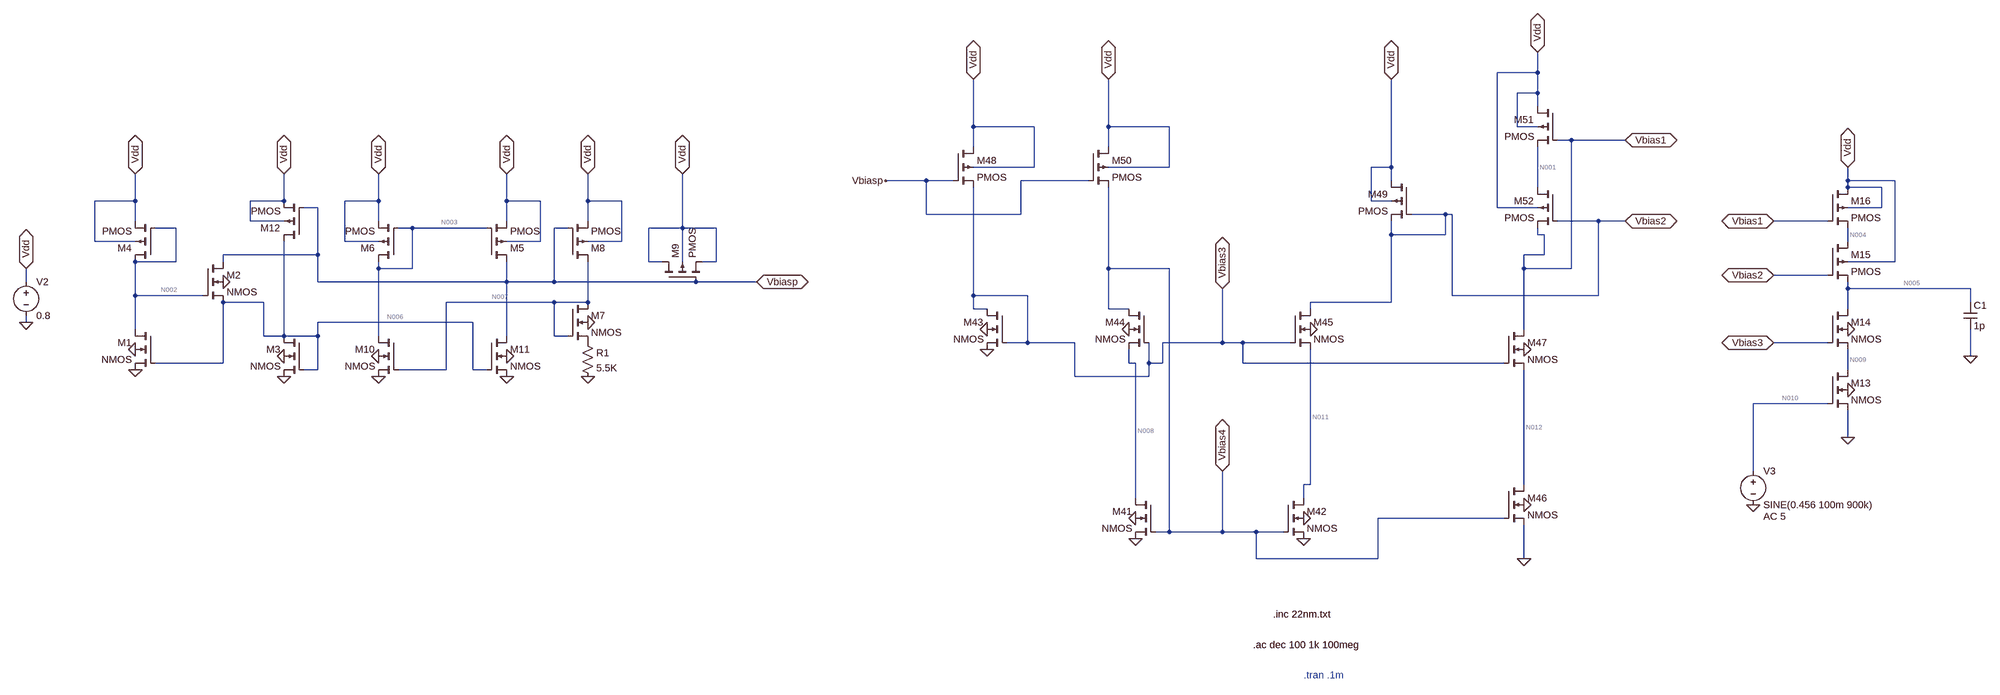
[diagram p0: schematic Schematic_22n.asc]
Schematic_22n.asc, the LTspice schematic file:
Version 4
SHEET 1 5816 3252
WIRE 3472 -384 3472 -432
WIRE 3472 -384 3376 -384
WIRE 3472 -336 3472 -384
WIRE 3472 -336 3424 -336
WIRE 3472 -304 3472 -336
WIRE 2064 -256 2064 -368
WIRE 2208 -256 2064 -256
WIRE 2384 -256 2384 -368
WIRE 2528 -256 2384 -256
WIRE 3424 -256 3424 -336
WIRE 3472 -256 3424 -256
WIRE 3552 -224 3520 -224
WIRE 3680 -224 3552 -224
WIRE 2064 -208 2064 -256
WIRE 2384 -208 2384 -256
WIRE 2208 -160 2208 -256
WIRE 2208 -160 2064 -160
WIRE 2528 -160 2528 -256
WIRE 2528 -160 2384 -160
WIRE 3104 -160 3104 -368
WIRE 3104 -160 3056 -160
WIRE 1952 -128 1856 -128
WIRE 2016 -128 1952 -128
WIRE 2336 -128 2176 -128
WIRE 3104 -128 3104 -160
WIRE 4832 -128 4832 -160
WIRE 4944 -128 4832 -128
WIRE 3472 -112 3472 -208
WIRE 4832 -112 4832 -128
WIRE 4912 -112 4832 -112
WIRE 0 -80 0 -144
WIRE 0 -80 -96 -80
WIRE 352 -80 352 -144
WIRE 352 -80 272 -80
WIRE 576 -80 576 -144
WIRE 576 -80 496 -80
WIRE 880 -80 880 -144
WIRE 960 -80 880 -80
WIRE 1072 -80 1072 -144
WIRE 1152 -80 1072 -80
WIRE 3056 -80 3056 -160
WIRE 3104 -80 3056 -80
WIRE 432 -64 400 -64
WIRE 3376 -64 3376 -384
WIRE 3472 -64 3376 -64
WIRE 4912 -64 4912 -112
WIRE 4912 -64 4832 -64
WIRE 1952 -48 1952 -128
WIRE 2176 -48 2176 -128
WIRE 2176 -48 1952 -48
WIRE 3232 -48 3152 -48
WIRE 3248 -48 3232 -48
WIRE 0 -32 0 -80
WIRE 272 -32 272 -80
WIRE 352 -32 272 -32
WIRE 576 -32 576 -80
WIRE 880 -32 880 -80
WIRE 1072 -32 1072 -80
WIRE 3616 -32 3520 -32
WIRE 3680 -32 3616 -32
WIRE 4784 -32 4656 -32
WIRE 96 -16 48 -16
WIRE 656 -16 624 -16
WIRE 832 -16 656 -16
WIRE 1024 -16 992 -16
WIRE 1296 -16 1296 -144
WIRE 1296 -16 1216 -16
WIRE 1376 -16 1296 -16
WIRE 3104 0 3104 -32
WIRE 3232 0 3232 -48
WIRE 3232 0 3104 0
WIRE 3472 0 3472 -16
WIRE 3488 0 3472 0
WIRE -96 16 -96 -80
WIRE 0 16 -96 16
WIRE 496 16 496 -80
WIRE 576 16 496 16
WIRE 960 16 960 -80
WIRE 960 16 880 16
WIRE 1152 16 1152 -80
WIRE 1152 16 1072 16
WIRE 4832 16 4832 -16
WIRE 432 48 432 -64
WIRE 432 48 208 48
WIRE 3488 48 3488 0
WIRE 3488 48 3440 48
WIRE 0 64 0 48
WIRE 96 64 96 -16
WIRE 96 64 0 64
WIRE 208 64 208 48
WIRE 1216 64 1216 -16
WIRE 1248 64 1216 64
WIRE 1296 64 1296 -16
WIRE 1376 64 1376 -16
WIRE 1376 64 1344 64
WIRE 4944 64 4944 -128
WIRE 4944 64 4832 64
WIRE 576 80 576 64
WIRE 656 80 656 -16
WIRE 656 80 576 80
WIRE 2384 80 2384 -112
WIRE 2528 80 2384 80
WIRE 3440 80 3440 48
WIRE 3552 80 3552 -224
WIRE 3552 80 3440 80
WIRE 4784 96 4656 96
WIRE -432 112 -432 80
WIRE 432 112 432 48
WIRE 880 112 880 64
WIRE 880 112 432 112
WIRE 992 112 992 -16
WIRE 992 112 880 112
WIRE 1328 112 992 112
WIRE 1472 112 1328 112
WIRE 4832 128 4832 112
WIRE 5136 128 4832 128
WIRE 0 144 0 64
WIRE 160 144 0 144
WIRE 2064 144 2064 -112
WIRE 2192 144 2064 144
WIRE 3248 144 3248 -48
WIRE 3616 144 3616 -32
WIRE 3616 144 3248 144
WIRE 304 160 208 160
WIRE 992 160 736 160
WIRE 1072 160 1072 64
WIRE 1072 160 992 160
WIRE 3104 160 3104 0
WIRE 3104 160 2912 160
WIRE 5136 160 5136 128
WIRE 2064 176 2064 144
WIRE 2096 176 2064 176
WIRE 2384 176 2384 80
WIRE 2432 176 2384 176
WIRE 2912 176 2912 160
WIRE 4832 176 4832 128
WIRE -432 208 -432 192
WIRE 800 208 432 208
WIRE 0 224 0 144
WIRE 3440 224 3440 80
WIRE 304 240 304 160
WIRE 352 240 352 16
WIRE 352 240 304 240
WIRE 432 240 432 208
WIRE 432 240 352 240
WIRE 576 240 576 80
WIRE 880 240 880 112
WIRE 992 240 992 160
WIRE 1024 240 992 240
WIRE 352 256 352 240
WIRE 2192 256 2192 144
WIRE 2192 256 2144 256
WIRE 2304 256 2192 256
WIRE 2704 256 2704 128
WIRE 2704 256 2512 256
WIRE 2752 256 2704 256
WIRE 2864 256 2752 256
WIRE 4784 256 4656 256
WIRE 5136 288 5136 224
WIRE 208 304 208 160
WIRE 208 304 48 304
WIRE 2432 304 2432 272
WIRE 2448 304 2432 304
WIRE 2480 304 2480 256
WIRE 2512 304 2512 256
WIRE 2512 304 2480 304
WIRE 2752 304 2752 256
WIRE 3392 304 2752 304
WIRE 432 320 432 240
WIRE 432 320 400 320
WIRE 736 320 736 160
WIRE 736 320 624 320
WIRE 800 320 800 208
WIRE 832 320 800 320
WIRE 4832 320 4832 272
WIRE 2304 336 2304 256
WIRE 2480 336 2480 304
WIRE 2480 336 2304 336
WIRE 4784 400 4608 400
WIRE 4832 480 4832 416
WIRE 4608 560 4608 400
WIRE 2912 592 2912 272
WIRE 2912 592 2896 592
WIRE 3440 592 3440 320
WIRE 2448 624 2448 304
WIRE 2896 624 2896 592
WIRE 3392 672 3072 672
WIRE 2528 704 2528 80
WIRE 2528 704 2496 704
WIRE 2704 704 2704 560
WIRE 2704 704 2528 704
WIRE 2784 704 2704 704
WIRE 2848 704 2784 704
WIRE 2784 768 2784 704
WIRE 3072 768 3072 672
WIRE 3072 768 2784 768
WIRE 3440 768 3440 688
FLAG 0 320 0
FLAG 352 336 0
FLAG 576 336 0
FLAG 880 336 0
FLAG 1072 336 0
FLAG 1072 208 0
FLAG 0 272 0
FLAG 352 288 0
FLAG 576 288 0
FLAG 880 288 0
FLAG -432 208 0
FLAG -432 80 Vdd
IOPIN -432 80 BiDir
FLAG 576 -144 Vdd
IOPIN 576 -144 BiDir
FLAG 352 -144 Vdd
IOPIN 352 -144 BiDir
FLAG 0 -144 Vdd
IOPIN 0 -144 BiDir
FLAG 880 -144 Vdd
IOPIN 880 -144 BiDir
FLAG 1072 -144 Vdd
IOPIN 1072 -144 BiDir
FLAG 1296 -144 Vdd
IOPIN 1296 -144 BiDir
FLAG 4656 96 Vbias2
IOPIN 4656 96 BiDir
FLAG 208 112 0
FLAG 1472 112 Vbiasp
IOPIN 1472 112 BiDir
FLAG 2448 720 0
FLAG 2896 720 0
FLAG 2448 672 0
FLAG 2896 672 0
FLAG 2096 272 0
FLAG 2096 224 0
FLAG 2432 224 0
FLAG 2912 224 0
FLAG 3440 768 0
FLAG 3440 640 0
FLAG 3440 272 0
FLAG 1856 -128 Vbiasp
FLAG 2064 -368 Vdd
IOPIN 2064 -368 BiDir
FLAG 2384 -368 Vdd
IOPIN 2384 -368 BiDir
FLAG 3104 -368 Vdd
IOPIN 3104 -368 BiDir
FLAG 3472 -432 Vdd
IOPIN 3472 -432 BiDir
FLAG 3680 -224 Vbias1
IOPIN 3680 -224 BiDir
FLAG 3680 -32 Vbias2
IOPIN 3680 -32 BiDir
FLAG 2704 128 Vbias3
IOPIN 2704 128 BiDir
FLAG 2704 560 Vbias4
IOPIN 2704 560 BiDir
FLAG 5136 288 0
FLAG 4608 640 0
FLAG 4832 480 0
FLAG 4832 368 0
FLAG 4832 224 0
FLAG 4656 256 Vbias3
IOPIN 4656 256 BiDir
FLAG 4656 -32 Vbias1
IOPIN 4656 -32 BiDir
FLAG 4832 -160 Vdd
IOPIN 4832 -160 BiDir
SYMBOL nmos4 48 224 M0
SYMATTR InstName M1
SYMATTR Value2 l=44n w=220n
SYMBOL nmos4 160 64 R0
SYMATTR InstName M2
SYMATTR Value2 l=44n w=88n
SYMBOL nmos4 400 240 M0
SYMATTR InstName M3
SYMATTR Value2 l=44n w=220n
SYMBOL pmos4 48 64 R180
SYMATTR InstName M4
SYMATTR Value2 l=440n w=220n
SYMBOL pmos4 832 64 M180
SYMATTR InstName M5
SYMATTR Value2 l=44n w=528n
SYMBOL pmos4 624 64 R180
SYMATTR InstName M6
SYMATTR Value2 l=44n w=528n
SYMBOL nmos4 1024 160 R0
SYMATTR InstName M7
SYMATTR Value2 l=44n w=660n
SYMBOL res 1056 240 R0
SYMATTR InstName R1
SYMATTR Value 5.5K
SYMBOL pmos4 1024 64 M180
SYMATTR InstName M8
SYMATTR Value2 l=44n w=528n
SYMBOL pmos4 1248 112 R270
SYMATTR InstName M9
SYMATTR Value2 l=1100n w=1100n
SYMBOL nmos4 624 240 M0
SYMATTR InstName M10
SYMATTR Value2 l=44n w=220n
SYMBOL nmos4 832 240 R0
SYMATTR InstName M11
SYMATTR Value2 l=44n w=220n
SYMBOL pmos4 400 16 R180
SYMATTR InstName M12
SYMATTR Value2 l=44n w=528n
SYMBOL voltage -432 96 R0
WINDOW 123 0 0 Left 0
WINDOW 39 0 0 Left 0
SYMATTR InstName V2
SYMATTR Value 0.8
SYMBOL nmos4 2496 624 M0
SYMATTR InstName M41
SYMATTR Value2 l=22n w=110n
SYMBOL nmos4 2848 624 R0
SYMATTR InstName M42
SYMATTR Value2 l=22n w=110n
SYMBOL nmos4 2144 176 M0
SYMATTR InstName M43
SYMATTR Value2 l=22n w=55n
SYMBOL nmos4 2480 176 M0
SYMATTR InstName M44
SYMATTR Value2 l=22n w=110n
SYMBOL nmos4 2864 176 R0
SYMATTR InstName M45
SYMATTR Value2 l=22n w=110n
SYMBOL nmos4 3392 592 R0
SYMATTR InstName M46
SYMATTR Value2 l=22n w=110n
SYMBOL nmos4 3392 224 R0
SYMATTR InstName M47
SYMATTR Value2 l=22n w=110n
SYMBOL pmos4 2016 -208 R0
SYMATTR InstName M48
SYMATTR Value2 l=22n w=264n
SYMBOL pmos4 3152 -128 M0
SYMATTR InstName M49
SYMATTR Value2 l=22n w=88n
SYMBOL pmos4 2336 -208 R0
SYMATTR InstName M50
SYMATTR Value2 l=22n w=264n
SYMBOL pmos4 3520 -304 M0
SYMATTR InstName M51
SYMATTR Value2 l=22n w=264n
SYMBOL pmos4 3520 -112 M0
SYMATTR InstName M52
SYMATTR Value2 l=22n w=264n
SYMBOL voltage 4608 544 R0
WINDOW 123 24 124 Left 2
WINDOW 39 0 0 Left 0
SYMATTR Value2 AC 5
SYMATTR InstName V3
SYMATTR Value SINE(0.456 100m 900k)
SYMBOL cap 5120 160 R0
SYMATTR InstName C1
SYMATTR Value 1p
SYMBOL nmos4 4784 320 R0
SYMATTR InstName M13
SYMATTR Value2 l=22n w=374n
SYMBOL nmos4 4784 176 R0
SYMATTR InstName M14
SYMATTR Value2 l=22n w=330n
SYMBOL pmos4 4784 16 R0
SYMATTR InstName M15
SYMATTR Value2 l=22n w=500n
SYMBOL pmos4 4784 -112 R0
SYMATTR InstName M16
SYMATTR Value2 l=22n w=748n
TEXT 2824 928 Left 2 !.inc 22nm.txt
TEXT 2896 1072 Left 2 ;.tran .1m
TEXT 2776 1000 Left 2 !.ac dec 100 1k 100meg

The netlist it stands for:
* Schematic_22n.asc
M1 N002 N006 0 0 NMOS l=44n w=220n
M2 Vbiasp N002 N006 0 NMOS l=44n w=88n
M3 N006 N006 0 0 NMOS l=44n w=220n
M4 N002 N002 Vdd Vdd PMOS l=440n w=220n
M5 Vbiasp N003 Vdd Vdd PMOS l=44n w=528n
M6 N003 N003 Vdd Vdd PMOS l=44n w=528n
M7 N007 N007 P001 0 NMOS l=44n w=660n
R1 P001 0 5.5K
M8 N007 Vbiasp Vdd Vdd PMOS l=44n w=528n
M9 Vdd Vbiasp Vdd Vdd PMOS l=1100n w=1100n
M10 N003 N007 0 0 NMOS l=44n w=220n
M11 Vbiasp N006 0 0 NMOS l=44n w=220n
M12 N006 Vbiasp Vdd Vdd PMOS l=44n w=528n
V2 Vdd 0 0.8
M41 N008 Vbias4 0 0 NMOS l=22n w=110n
M42 N011 Vbias4 0 0 NMOS l=22n w=110n
M43 Vbias3 Vbias3 0 0 NMOS l=22n w=55n
M44 Vbias4 Vbias3 N008 0 NMOS l=22n w=110n
M45 Vbias2 Vbias3 N011 0 NMOS l=22n w=110n
M46 N012 Vbias4 0 0 NMOS l=22n w=110n
M47 Vbias1 Vbias3 N012 0 NMOS l=22n w=110n
M48 Vdd Vbiasp Vbias3 Vdd PMOS l=22n w=264n
M49 Vdd Vbias2 Vbias2 Vdd PMOS l=22n w=88n
M50 Vdd Vbiasp Vbias4 Vdd PMOS l=22n w=264n
M51 Vdd Vbias1 N001 Vdd PMOS l=22n w=264n
M52 N001 Vbias2 Vbias1 Vdd PMOS l=22n w=264n
V3 N010 0 SINE(0.456 100m 900k) AC 5
C1 N005 0 1p
M13 N009 N010 0 0 NMOS l=22n w=374n
M14 N005 Vbias3 N009 0 NMOS l=22n w=330n
M15 N004 Vbias2 N005 Vdd PMOS l=22n w=500n
M16 Vdd Vbias1 N004 Vdd PMOS l=22n w=748n
.model NMOS NMOS
.model PMOS PMOS
.lib standard.mos
.inc 22nm.txt
* .tran .1m
.ac dec 100 1k 100meg
.backanno
.end

* Results of the author's LTspice run, read from the files saved beside the schematic
* Operating Point, zero values left out:
*   V(n002) = 14.67 mV
*   V(n006) = 539.9 mV
*   V(vbiasp) = 248.5 mV
*   V(vdd) = 800 mV
*   V(n003) = 265.7 mV
*   V(n007) = 538.9 mV
*   V(p001) = 52.71 mV
*   V(n008) = 103.2 mV
*   V(vbias4) = 632.7 mV
*   V(n011) = 65.09 mV
*   V(vbias3) = 604.5 mV
*   V(vbias2) = 274.5 mV
*   V(n012) = 61.79 mV
*   V(vbias1) = 243.1 mV
*   V(n001) = 706.3 mV
*   V(n010) = 456 mV
*   V(n005) = 586.2 mV
*   V(n009) = 170 mV
*   V(n004) = 759.8 mV
*   Id(M1) = 2.042 µA
*   Ig(M1) = 18.24 pA
*   Is(M1) = -2.042 µA
*   Id(M2) = 1.07 pA
*   Ig(M2) = -6.519 pA
*   Is(M2) = 6.247 pA
*   Id(M3) = 9.579 µA
*   Ig(M3) = 13.67 pA
*   Is(M3) = -9.579 µA
*   Id(M7) = 9.584 µA
*   Ig(M7) = 16.33 pA
*   Is(M7) = -9.584 µA
*   Id(M10) = 8.519 µA
*   Ig(M10) = 13.84 pA
*   Is(M10) = -8.519 µA
*   Id(M11) = 8.586 µA
*   Ig(M11) = 14.18 pA
*   Is(M11) = -8.586 µA
*   Id(M41) = 29.23 µA
*   Ig(M41) = 11.56 pA
*   Is(M41) = -29.23 µA
*   Id(M42) = 20.21 µA
*   Ig(M42) = 12.15 pA
*   Is(M42) = -20.21 µA
*   Id(M43) = 32.77 µA
*   Ig(M43) = 3.578 pA
*   Is(M43) = -32.77 µA
*   Id(M44) = 29.23 µA
*   Ig(M44) = 2.236 pA
*   Is(M44) = -29.23 µA
*   Id(M45) = 20.21 µA
*   Ig(M45) = 3.982 pA
*   Is(M45) = -20.21 µA
*   Id(M46) = 19.33 µA
*   Ig(M46) = 12.2 pA
*   Is(M46) = -19.33 µA
*   Id(M47) = 19.33 µA
*   Ig(M47) = 4.274 pA
*   Is(M47) = -19.33 µA
*   Id(M13) = 26.16 µA
*   Ig(M13) = 5.773 pA
*   Is(M13) = -26.16 µA
*   Id(M14) = 26.16 µA
*   Ig(M14) = 3.613 pA
*   Is(M14) = -26.16 µA
*   Id(M4) = -2.042 µA
*   Ig(M4) = -58.17 pA
*   Ib(M4) = 58.89 pA
*   Is(M4) = 2.042 µA
*   Id(M5) = -8.586 µA
*   Is(M5) = 8.586 µA
*   Id(M6) = -8.519 µA
*   Is(M6) = 8.519 µA
*   Id(M8) = -9.584 µA
*   Is(M8) = 9.584 µA
*   Ig(M9) = -10.79 pA
*   Ib(M9) = 10.68 pA
*   Id(M12) = -9.579 µA
*   Is(M12) = 9.579 µA
*   Id(M48) = 32.77 µA
*   Is(M48) = -32.77 µA
*   Id(M49) = 20.21 µA
*   Is(M49) = -20.21 µA
*   Id(M50) = 29.23 µA
*   Is(M50) = -29.23 µA
*   Id(M51) = 19.33 µA
*   Is(M51) = -19.33 µA
*   Id(M52) = 19.33 µA
*   Is(M52) = -19.33 µA
*   Id(M15) = 26.16 µA
*   Is(M15) = -26.16 µA
*   Id(M16) = 26.16 µA
*   Is(M16) = -26.16 µA
*   I(R1) = 9.584 µA
*   I(V2) = -166 µA
*   I(V3) = -5.773 pA
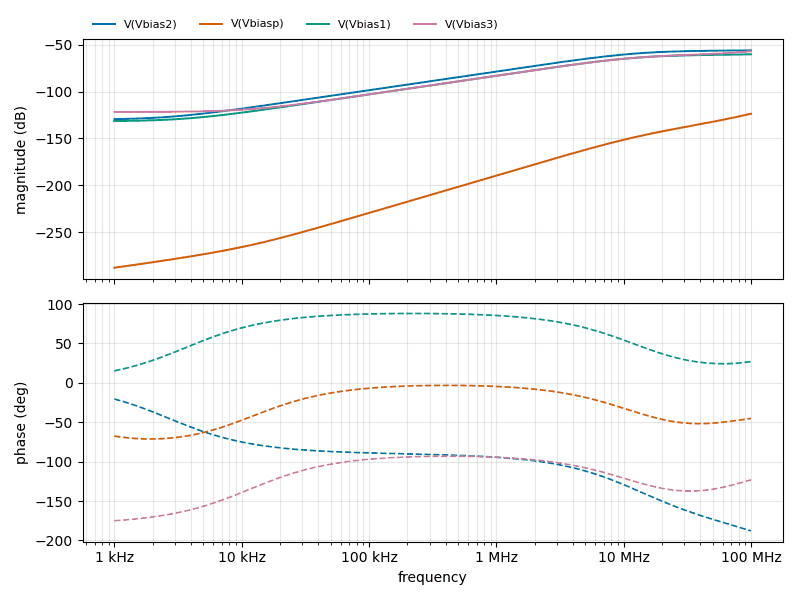
[diagram p1: AC Analysis of Schematic_22n.asc, plotted from the saved traces]
* AC Analysis, 1 run:
*   V(Vbias2): -129.39 dB at 1 kHz, -56.03 dB at 100 MHz, peak -56.03 dB at 100 MHz, 3 dB below the peak at 13.65 MHz
*   V(Vbiasp): -287.69 dB at 1 kHz, -123.64 dB at 100 MHz, peak -123.64 dB at 100 MHz, 3 dB below the peak at 79.51 MHz
*   V(Vbias1): -131.42 dB at 1 kHz, -60.30 dB at 100 MHz, peak -60.30 dB at 100 MHz, 3 dB below the peak at 14.49 MHz
*   V(Vbias3): -121.75 dB at 1 kHz, -57.10 dB at 100 MHz, peak -57.10 dB at 100 MHz, 3 dB below the peak at 44.54 MHz